# Altium schematic sheet PAGE02_ BLOCK DIAGRAM.SchDoc
size 246 x 182 mm
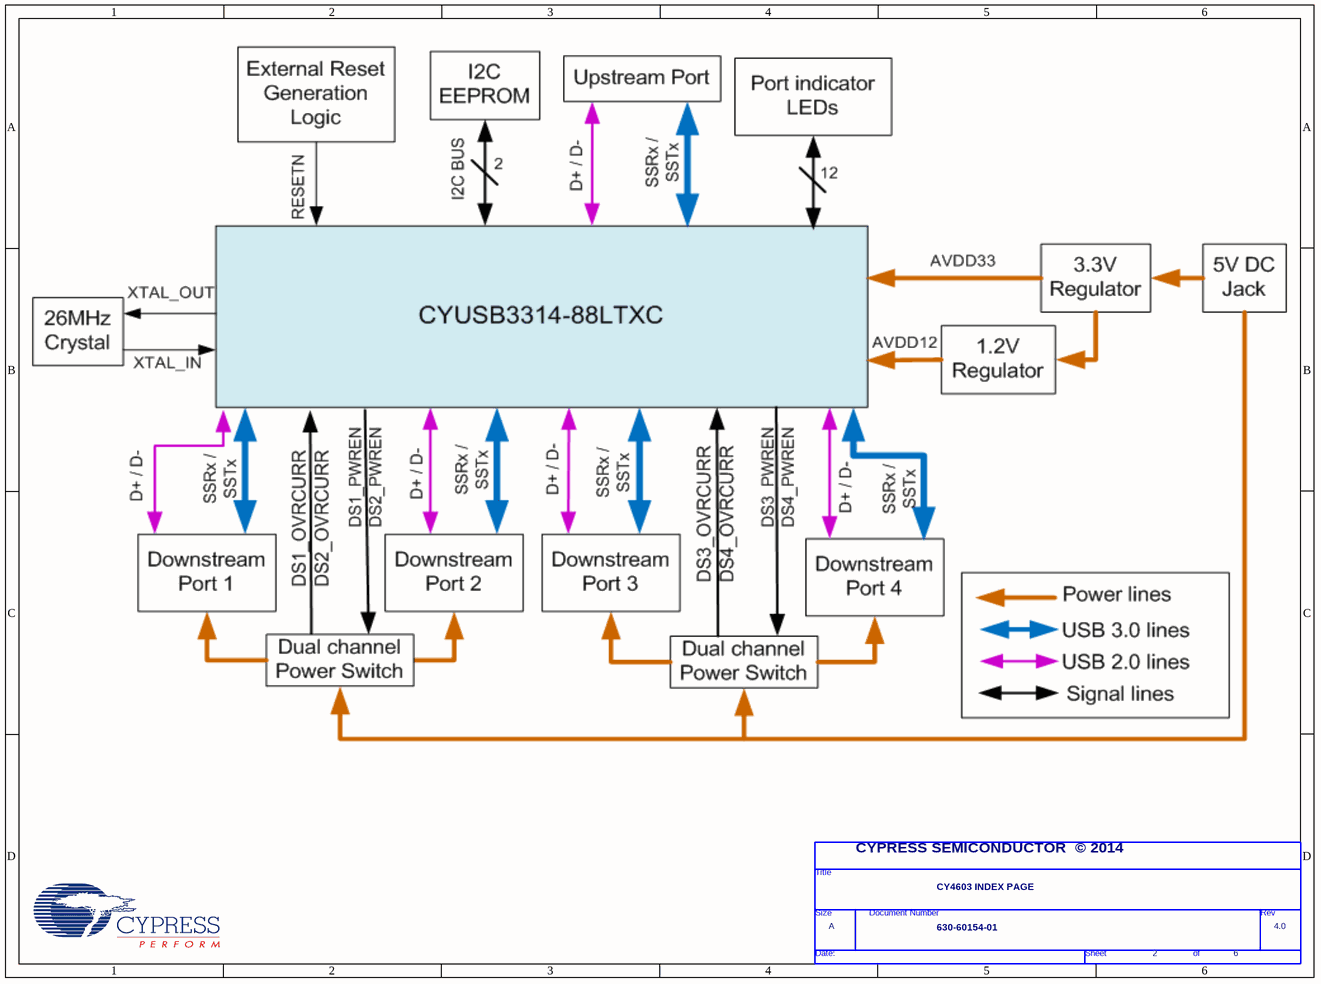
[diagram p0: PAGE02_ BLOCK DIAGRAM.SchDoc]

## Parts
*  Page Count: 6  Page Number: 2  Page Size: A  Title: CY4603 INDEX PAGE  RevCode: 4.0  Doc: 630-60154-01  (hidden comment: TitleBlock0)  (graphical)

## Notes on the sheet
- (near *) CYPRESS SEMICONDUCTOR  © 2014
- (in symbol TitleBlock0) Title; Size; Document Number; Rev; Date:; Sheet; of

## Library data of the parts
* = TitleBlock0: Page Create Date: March  8, 1995